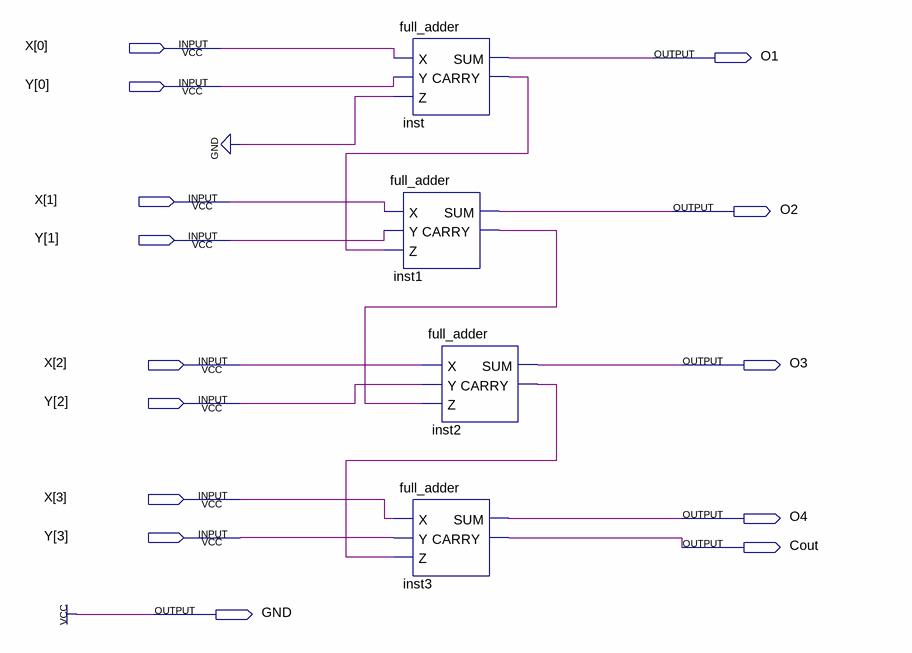
[diagram p0: schematic sheet]
// Quartus schematic 4bitfulladder.bdf as structural Verilog: 4 symbols, 14 pins
module \4bitfulladder  (
  input  [3:0] X,
  input  [3:0] Y,
  output O1,
  output O2,
  output O3,
  output O4,
  output Cout,
  output GND
);

  wire inst1_carry, inst2_carry, inst_carry;

  full_adder inst1 (.X(X[1]), .Y(Y[1]), .Z(inst_carry), .SUM(O2), .CARRY(inst1_carry));
  full_adder inst (.X(X[0]), .Y(Y[0]), .Z(1'b0), .SUM(O1), .CARRY(inst_carry));
  full_adder inst2 (.X(X[2]), .Y(Y[2]), .Z(inst1_carry), .SUM(O3), .CARRY(inst2_carry));
  full_adder inst3 (.X(X[3]), .Y(Y[3]), .Z(inst2_carry), .SUM(O4), .CARRY(Cout));

  assign GND = 1'b1;
endmodule
